# EAGLE design MX4-7-9-ESP12 (EAGLE 7.7.0)
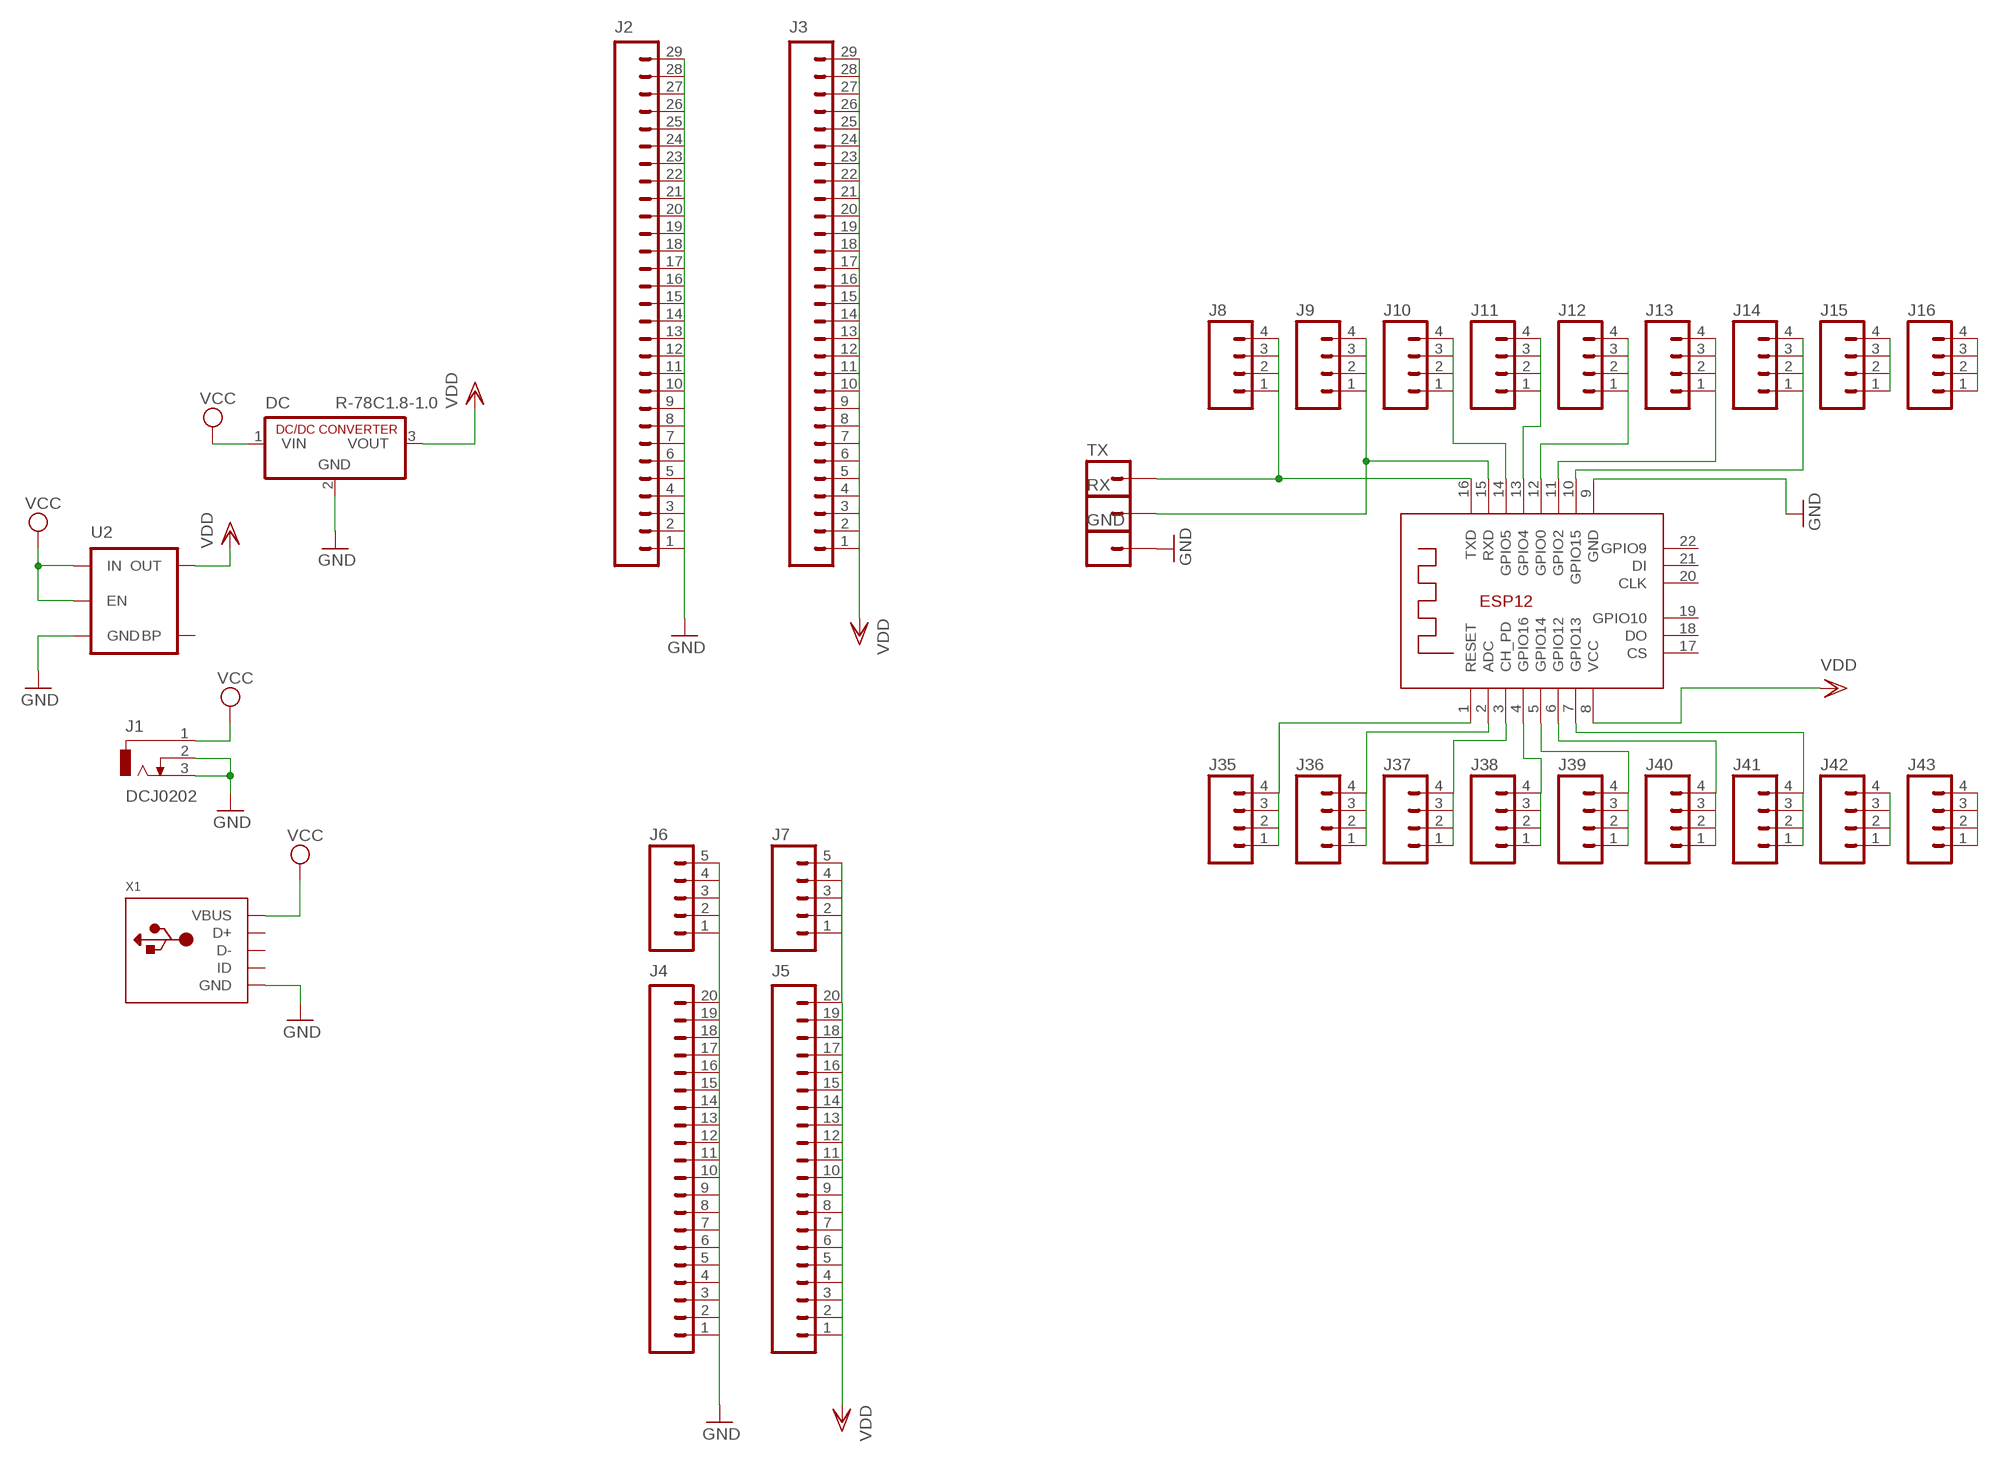
[diagram p0: schematic, sheet 1, part 1 of 2]
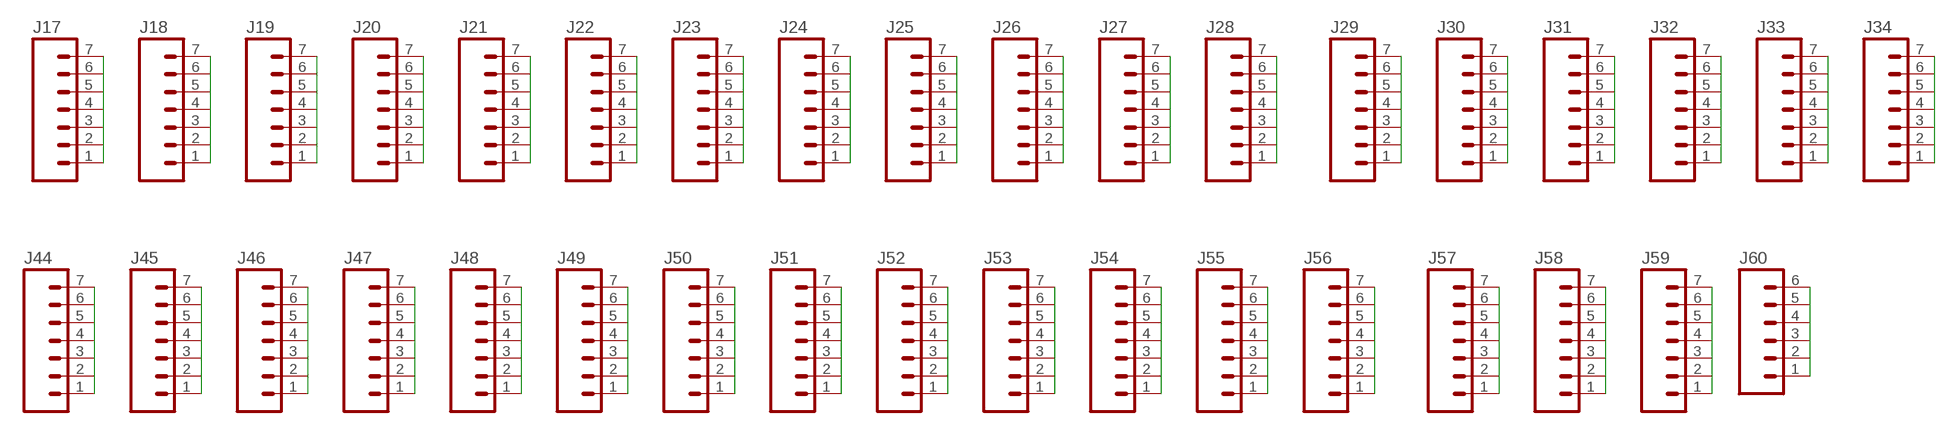
[diagram p1: schematic, sheet 1, part 2 of 2]

## Parts
DC  R-78C1.8-1.0  [SIP3]
GND  M01PTH_NO_SILK_YES_STOP  [1X01_NO_SILK]
J1  DCJ0202  [DCJ0202]
J2  M29NO_SILK  [1X29_NO_SILK]
J3  M29NO_SILK  [1X29_NO_SILK]
J4  M20NO_SILK_KIT  [1X20_NO_SILK_KIT]
J5  M20NO_SILK_KIT  [1X20_NO_SILK_KIT]
J6  M05NO_SILK  [1X05_NO_SILK]
J7  M05NO_SILK  [1X05_NO_SILK]
J8  M04NO_SILK_ALL_ROUND  [1X04_NO_SILK_ALL_ROUND]
J9  M04NO_SILK_ALL_ROUND  [1X04_NO_SILK_ALL_ROUND]
J10  M04NO_SILK_ALL_ROUND  [1X04_NO_SILK_ALL_ROUND]
J11  M04NO_SILK_ALL_ROUND  [1X04_NO_SILK_ALL_ROUND]
J12  M04NO_SILK_ALL_ROUND  [1X04_NO_SILK_ALL_ROUND]
J13  M04NO_SILK_ALL_ROUND  [1X04_NO_SILK_ALL_ROUND]
J14  M04NO_SILK_ALL_ROUND  [1X04_NO_SILK_ALL_ROUND]
J15  M04NO_SILK_ALL_ROUND  [1X04_NO_SILK_ALL_ROUND]
J16  M04NO_SILK_ALL_ROUND  [1X04_NO_SILK_ALL_ROUND]
J17  M07NO_SILK  [1X07_NO_SILK]
J18  M07NO_SILK  [1X07_NO_SILK]
J19  M07NO_SILK  [1X07_NO_SILK]
J20  M07NO_SILK  [1X07_NO_SILK]
J21  M07NO_SILK  [1X07_NO_SILK]
J22  M07NO_SILK  [1X07_NO_SILK]
J23  M07NO_SILK  [1X07_NO_SILK]
J24  M07NO_SILK  [1X07_NO_SILK]
J25  M07NO_SILK  [1X07_NO_SILK]
J26  M07NO_SILK  [1X07_NO_SILK]
J27  M07NO_SILK  [1X07_NO_SILK]
J28  M07NO_SILK  [1X07_NO_SILK]
J29  M07NO_SILK  [1X07_NO_SILK]
J30  M07NO_SILK  [1X07_NO_SILK]
J31  M07NO_SILK  [1X07_NO_SILK]
J32  M07NO_SILK  [1X07_NO_SILK]
J33  M07NO_SILK  [1X07_NO_SILK]
J34  M07NO_SILK  [1X07_NO_SILK]
J35  M04NO_SILK_ALL_ROUND  [1X04_NO_SILK_ALL_ROUND]
J36  M04NO_SILK_ALL_ROUND  [1X04_NO_SILK_ALL_ROUND]
J37  M04NO_SILK_ALL_ROUND  [1X04_NO_SILK_ALL_ROUND]
J38  M04NO_SILK_ALL_ROUND  [1X04_NO_SILK_ALL_ROUND]
J39  M04NO_SILK_ALL_ROUND  [1X04_NO_SILK_ALL_ROUND]
J40  M04NO_SILK_ALL_ROUND  [1X04_NO_SILK_ALL_ROUND]
J41  M04NO_SILK_ALL_ROUND  [1X04_NO_SILK_ALL_ROUND]
J42  M04NO_SILK_ALL_ROUND  [1X04_NO_SILK_ALL_ROUND]
J43  M04NO_SILK_ALL_ROUND  [1X04_NO_SILK_ALL_ROUND]
J44  M07NO_SILK  [1X07_NO_SILK]
J45  M07NO_SILK  [1X07_NO_SILK]
J46  M07NO_SILK  [1X07_NO_SILK]
J47  M07NO_SILK  [1X07_NO_SILK]
J48  M07NO_SILK  [1X07_NO_SILK]
J49  M07NO_SILK  [1X07_NO_SILK]
J50  M07NO_SILK  [1X07_NO_SILK]
J51  M07NO_SILK  [1X07_NO_SILK]
J52  M07NO_SILK  [1X07_NO_SILK]
J53  M07NO_SILK  [1X07_NO_SILK]
J54  M07NO_SILK  [1X07_NO_SILK]
J55  M07NO_SILK  [1X07_NO_SILK]
J56  M07NO_SILK  [1X07_NO_SILK]
J57  M07NO_SILK  [1X07_NO_SILK]
J58  M07NO_SILK  [1X07_NO_SILK]
J59  M07NO_SILK  [1X07_NO_SILK]
J60  M06NO_SILK_FEMALE_PTH  [1X06_NO_SILK]
RX  M01PTH_NO_SILK_YES_STOP  [1X01_NO_SILK]
TX  M01PTH_NO_SILK_YES_STOP  [1X01_NO_SILK]
U2  MIC52053.3V  [SOT23-5]
X1  USBMICRO_20329  [4UCONN_20329]
X2  ESP-12E  [ESP-12E]

## Nets
GND: DC.2(GND) GND.1 J1.2 J1.3 J2.1 J2.2 J2.3 J2.4 J2.5 J2.6 J2.7 J2.8 J2.9 J2.10 J2.11 J2.12 J2.13 J2.14 J2.15 J2.16 J2.17 J2.18 J2.19 J2.20 J2.21 J2.22 J2.23 J2.24 J2.25 J2.26 J2.27 J2.28 J2.29 J4.1 J4.2 J4.3 J4.4 J4.5 J4.6 J4.7 J4.8 J4.9 J4.10 J4.11 J4.12 J4.13 J4.14 J4.15 J4.16 J4.17 J4.18 J4.19 J4.20 J6.1 J6.2 J6.3 J6.4 J6.5 U2.2(GND) X1.BASE@1(GND) X1.BASE@2(GND) X1.GND X1.SPRT@1(GND) X1.SPRT@2(GND) X1.SPRT@3(GND) X1.SPRT@4(GND) X2.9(GND)
N$1: J8.1 J8.2 J8.3 J8.4 TX.1 X2.16(TXD)
N$2: J9.1 J9.2 J9.3 J9.4 RX.1 X2.15(RXD)
N$3: J10.1 J10.2 J10.3 J10.4 X2.14(GPIO5)
N$4: J11.1 J11.2 J11.3 J11.4 X2.13(GPIO4)
N$5: J12.1 J12.2 J12.3 J12.4 X2.12(GPIO0)
N$6: J13.1 J13.2 J13.3 J13.4 X2.11(GPIO2)
N$7: J14.1 J14.2 J14.3 J14.4 X2.10(GPIO15)
N$8: J15.1 J15.2 J15.3 J15.4
N$9: J16.1 J16.2 J16.3 J16.4
N$10: J17.1 J17.2 J17.3 J17.4 J17.5 J17.6 J17.7
N$11: J18.1 J18.2 J18.3 J18.4 J18.5 J18.6 J18.7
N$12: J19.1 J19.2 J19.3 J19.4 J19.5 J19.6 J19.7
N$13: J20.1 J20.2 J20.3 J20.4 J20.5 J20.6 J20.7
N$14: J21.1 J21.2 J21.3 J21.4 J21.5 J21.6 J21.7
N$15: J22.1 J22.2 J22.3 J22.4 J22.5 J22.6 J22.7
N$16: J23.1 J23.2 J23.3 J23.4 J23.5 J23.6 J23.7
N$17: J24.1 J24.2 J24.3 J24.4 J24.5 J24.6 J24.7
N$18: J25.1 J25.2 J25.3 J25.4 J25.5 J25.6 J25.7
N$19: J26.1 J26.2 J26.3 J26.4 J26.5 J26.6 J26.7
N$20: J27.1 J27.2 J27.3 J27.4 J27.5 J27.6 J27.7
N$21: J28.1 J28.2 J28.3 J28.4 J28.5 J28.6 J28.7
N$22: J29.1 J29.2 J29.3 J29.4 J29.5 J29.6 J29.7
N$23: J30.1 J30.2 J30.3 J30.4 J30.5 J30.6 J30.7
N$24: J31.1 J31.2 J31.3 J31.4 J31.5 J31.6 J31.7
N$25: J35.1 J35.2 J35.3 J35.4 X2.1(RESET)
N$26: J32.1 J32.2 J32.3 J32.4 J32.5 J32.6 J32.7
N$27: J33.1 J33.2 J33.3 J33.4 J33.5 J33.6 J33.7
N$28: J34.1 J34.2 J34.3 J34.4 J34.5 J34.6 J34.7
N$29: J36.1 J36.2 J36.3 J36.4 X2.2(ADC)
N$30: J37.1 J37.2 J37.3 J37.4 X2.3(CH_PD)
N$31: J38.1 J38.2 J38.3 J38.4 X2.4(GPIO16)
N$32: J39.1 J39.2 J39.3 J39.4 X2.5(GPIO14)
N$33: J40.1 J40.2 J40.3 J40.4 X2.6(GPIO12)
N$34: J41.1 J41.2 J41.3 J41.4 X2.7(GPIO13)
N$35: J42.1 J42.2 J42.3 J42.4
N$36: J43.1 J43.2 J43.3 J43.4
N$38: J44.1 J44.2 J44.3 J44.4 J44.5 J44.6 J44.7
N$39: J45.1 J45.2 J45.3 J45.4 J45.5 J45.6 J45.7
N$40: J46.1 J46.2 J46.3 J46.4 J46.5 J46.6 J46.7
N$41: J47.1 J47.2 J47.3 J47.4 J47.5 J47.6 J47.7
N$43: J48.1 J48.2 J48.3 J48.4 J48.5 J48.6 J48.7
N$44: J49.1 J49.2 J49.3 J49.4 J49.5 J49.6 J49.7
N$46: J50.1 J50.2 J50.3 J50.4 J50.5 J50.6 J50.7
N$47: J51.1 J51.2 J51.3 J51.4 J51.5 J51.6 J51.7
N$48: J52.1 J52.2 J52.3 J52.4 J52.5 J52.6 J52.7
N$49: J53.1 J53.2 J53.3 J53.4 J53.5 J53.6 J53.7
N$50: J54.1 J54.2 J54.3 J54.4 J54.5 J54.6 J54.7
N$51: J55.1 J55.2 J55.3 J55.4 J55.5 J55.6 J55.7
N$52: J56.1 J56.2 J56.3 J56.4 J56.5 J56.6 J56.7
N$53: J57.1 J57.2 J57.3 J57.4 J57.5 J57.6 J57.7
N$54: J58.1 J58.2 J58.3 J58.4 J58.5 J58.6 J58.7
N$55: J59.1 J59.2 J59.3 J59.4 J59.5 J59.6 J59.7
N$56: J60.1 J60.2 J60.3 J60.4 J60.5 J60.6
VCC: DC.1(VIN) J1.1 U2.1(IN) U2.3(EN) X1.VBUS
VDD: DC.3(VOUT) J3.1 J3.2 J3.3 J3.4 J3.5 J3.6 J3.7 J3.8 J3.9 J3.10 J3.11 J3.12 J3.13 J3.14 J3.15 J3.16 J3.17 J3.18 J3.19 J3.20 J3.21 J3.22 J3.23 J3.24 J3.25 J3.26 J3.27 J3.28 J3.29 J5.1 J5.2 J5.3 J5.4 J5.5 J5.6 J5.7 J5.8 J5.9 J5.10 J5.11 J5.12 J5.13 J5.14 J5.15 J5.16 J5.17 J5.18 J5.19 J5.20 J7.1 J7.2 J7.3 J7.4 J7.5 U2.5(OUT) X2.8(VCC)
Unconnected: U2.4(BP) X1.D+ X1.D- X1.ID X2.17(CS) X2.18(DO) X2.19(GPIO10) X2.20(CLK) X2.21(DI) X2.22(GPIO9)

## Library data of the parts
DC = dc-dc-converter:R-78C*-1.0: INNOLINE DC/DC-Converter 1.0 AMP SIP3 Single Output Source: Data sheet <http://www.mikrocontroller.net/attachment/150645/157764-da-01-en-DC_DC_WANDLER_R_78C5_0_1_0.pdf>
GND RX TX = SparkFun-Connectors:M01: Header 1 Standard 1-pin 0.1" header. Use with straight break away headers (SKU : PRT-00116), right angle break away headers (PRT-00553), swiss pins (PRT-00743), machine pins (PRT-00117), and female headers (PRT-00115). SMTSO-256-ET is a "flush mount" nut for a 4-40 screw. The older package used to be too tight, and did not allow it to sit properly thru the drill hit. The latest (0.165DIA) fits nice and snug.
J1 = con-jack:DCJ0202: DC POWER JACK Source: DCJ0202.pdf; OC_FARNELL: unknown; OC_NEWARK: unknown
J2 J3 = SparkFun-Connectors:M29: 1x29 .1" header
J4 J5 = SparkFun-Connectors:M20: 1x20 .1" header This is just like the LOCK variant in that the holes are staggared by 5 mil, but except for the last two holes. They are not altered from the "standard" footprint layout. This is used for a special purpose on the layout of our Graphic LCD Backpack. Make sure you want to use this device before selecting it for you project!
J6 J7 = SparkFun-Connectors:M05: Header 5 Standard 5-pin 0.1" header. Use with straight break away headers (SKU : PRT-00116), right angle break away headers (PRT-00553), swiss pins (PRT-00743), machine pins (PRT-00117), and female headers (PRT-00115). Molex polarized connector foot print use with SKU : PRT-08230 with associated crimp pins and housings.
J8-J16 J35-J43 = SparkFun-Connectors:M04: Header 4 Standard 4-pin 0.1" header. Use with straight break away headers (SKU : PRT-00116), right angle break away headers (PRT-00553), swiss pins (PRT-00743), machine pins (PRT-00117), and female headers (PRT-00115). Molex polarized connector foot print use with SKU : PRT-08231 with associated crimp pins and housings. 1MM SMD Version SKU: PRT-10208; PROD_ID: CONN-09696
J17-J34 J44-J59 = SparkFun-Connectors:M07: Header 7 Standard 7-pin 0.1" header. Use with straight break away headers (SKU : PRT-00116), right angle break away headers (PRT-00553), swiss pins (PRT-00743), machine pins (PRT-00117), and female headers (PRT-00115). NOTES ON THE VARIANTS LOCK and LOCK_LONGPADS... This footprint was designed to help hold the alignment of a through-hole component (i.e. 7-pin header) while soldering it into place. You may notice that each hole has been shifted either up or down by 0.005 of an inch from it's more standard position (which is usually a perfectly straight line). This slight alteration caused the pins (the squares in the middle) to touch the edges of the holes. Because they are alternating, it causes a "brace" to hold the header in place. 0.005 has proven to be the perfect amount of "off-center" position when using our standard breakaway headers. Although looks a little odd when you look at the bare footprint, once you have a header in there, the alteration is very hard to notice. Also, if you push a header all the way into place, it is covered up entirely on the bottom side. This idea of altering the position of holes to aid alignment will be further integrated into the Sparkfun Library for other footprints. It can help hold any component with 3 or more connection pins.
J60 = SparkFun-Connectors:M06: Header 6 Standard 6-pin 0.1" header. Use with straight break away headers (SKU : PRT-00116), right angle break away headers (PRT-00553), swiss pins (PRT-00743), machine pins (PRT-00117), and female headers (PRT-00115). Molex polarized connector foot print use with SKU : PRT-08094 with associated crimp pins and housings. NOTES ON THE VARIANTS LOCK and LOCK_LONGPADS... This footprint was designed to help hold the alignment of a through-hole component (i.e. 6-pin header) while soldering it into place. You may notice that each hole has been shifted either up or down by 0.005 of an inch from it's more standard position (which is a perfectly straight line). This slight alteration caused the pins (the squares in the middle) to touch the edges of the holes. Because they are alternating, it causes a "brace" to hold the component in place. 0.005 has proven to be the perfect amount of "off-center" position when using our standard breakaway headers. Although looks a little odd when you look at the bare footprint, once you have a header in there, the alteration is very hard to notice. Also,if you push a header all the way into place, it is covered up entirely on the bottom side. This idea of altering the position of holes to aid alignment will be further integrated into the Sparkfun Library for other footprints. It can help hold any component with 3 or more connection pins.; PROD_ID: CONN-08437
U2 = SparkFun-PowerIC:MIC5205: MIC5205 150mA vreg 3.3V - VREG-00822 5V - VREG-00823; PROD_ID: VREG-00822
X1 = microbuilder:USB: USB Connectors USBMINIB - Surface Mount Female Mini-B USB Connector 4UConnector: 06564
X2 = microbuilder:ESP-12E

## Net classes
0 default: width 0.508 mm, drill 0.508 mm, clearance 0.127 mm

## Board
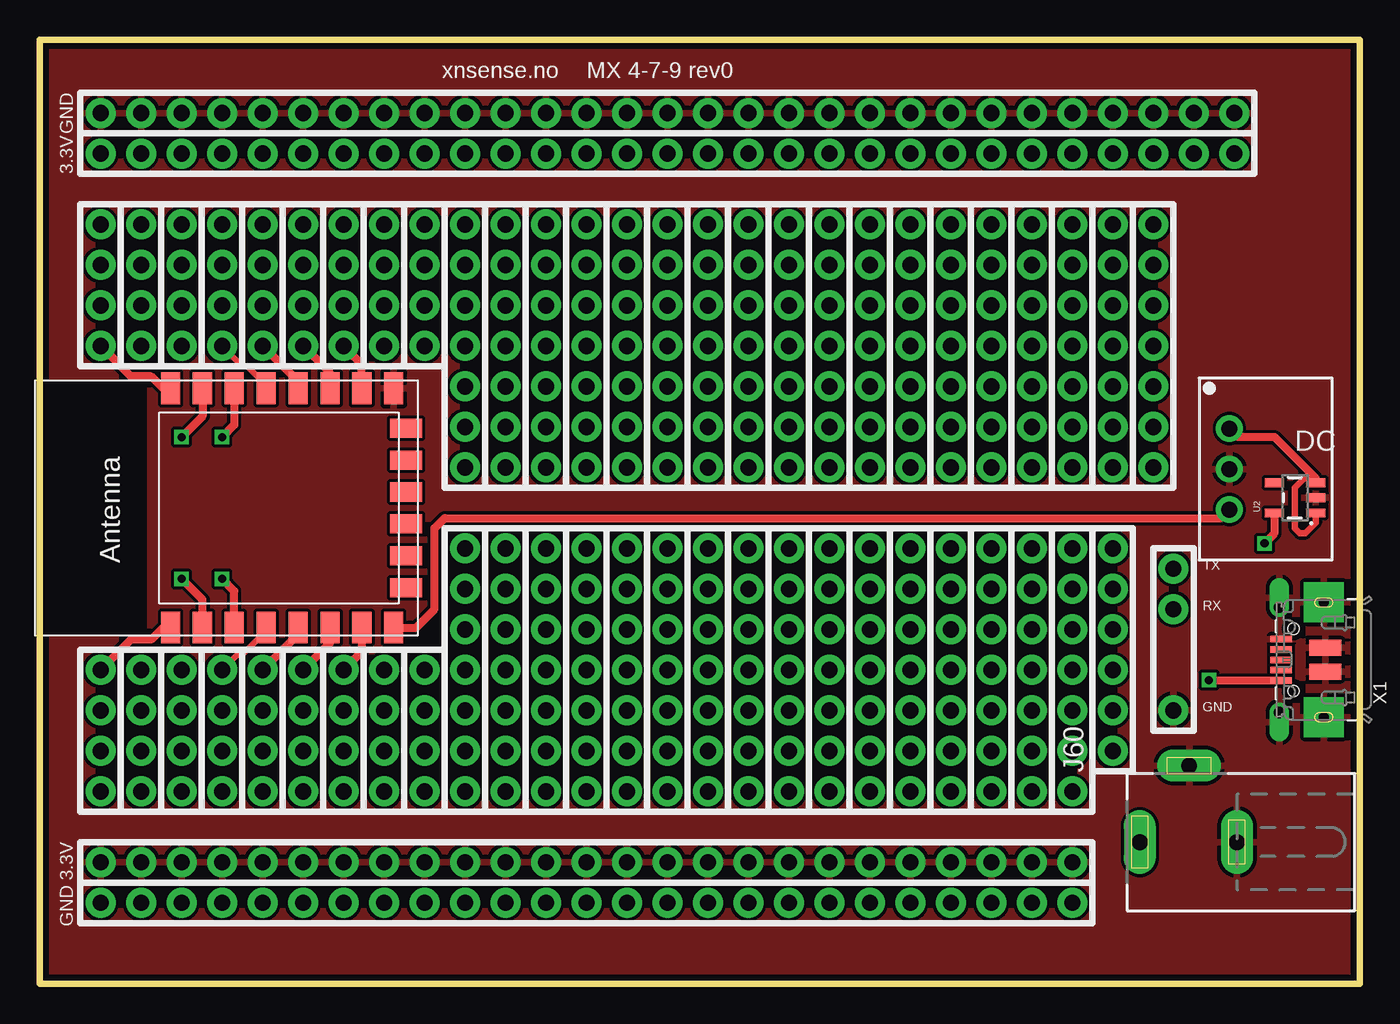
[diagram p2: board, top side]
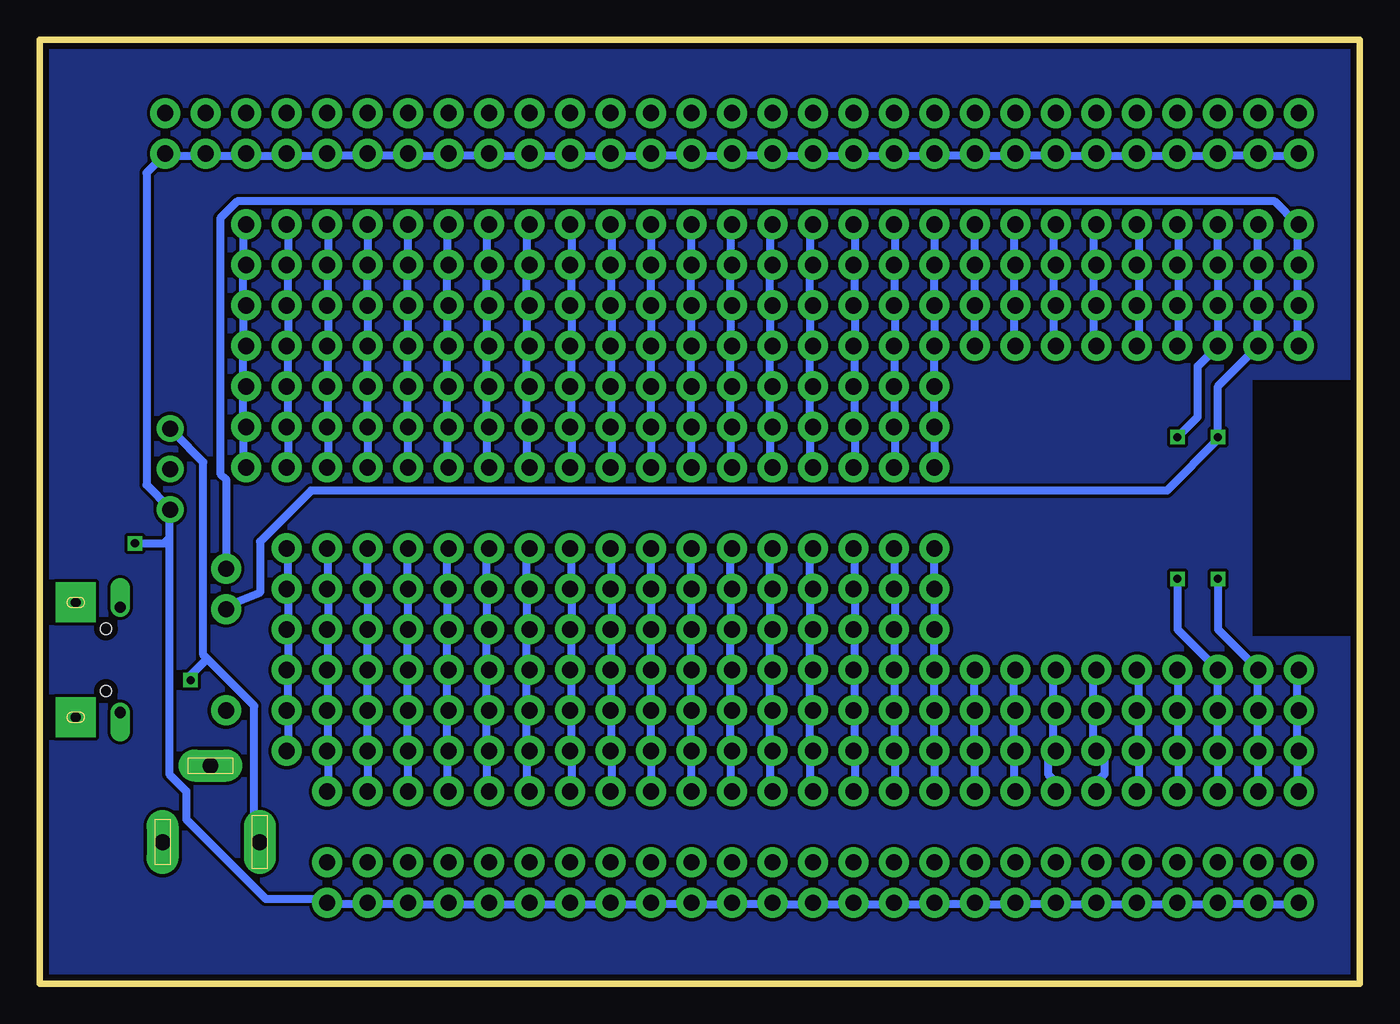
[diagram p3: board, bottom side, seen from below]

Size 82.8 x 59.2 mm. Coordinates in mm from the lower left corner, seen from the top.
Outline: 0,0 0,59.2 82.8,59.2 82.8,0 0,0
Copper layers (1*16): Top 0.035mm / dielectric 1.5mm / Bottom 0.035mm
Design rules "default *": minimum track width 10mil, minimum drill 20mil, track to track 8mil, track to pad 8mil, pad to pad 8mil, via to via 8mil, smd to smd 8mil, copper to edge 15mil, drill to drill 8mil, minimum pad ring 10mil, minimum via ring 8mil, stop-mask expansion 4mil, vias tented up to drill 0mil, thermal gap 10mil

### Footprints (pad centres in the part's own frame; a part is rotated, then mirrored left to right if it is on the bottom)
SIP3 = drill 1 pad 1.676: 1 -2.54,0; 2 0,0; 3 2.54,0
1X01_NO_SILK = drill 1.016 pad 1.88: 1 0,0
DCJ0202 = drill 1 pad 2 long: 1 0,3.1; 2 4.8,0; 3 0,-3
1X29_NO_SILK = drill 1.016 pad 1.88: 1 0,0; 2 2.54,0; 3 5.08,0; 4 7.62,0; 5 10.16,0; 6 12.7,0; 7 15.24,0; 8 17.78,0; 9 20.32,0; 10 22.86,0; 11 25.4,0; 12 27.94,0; 13 30.48,0; 14 33.02,0; 15 35.56,0; 16 38.1,0; 17 40.64,0; 18 43.18,0; 19 45.72,0; 20 48.26,0; 21 50.8,0; 22 53.34,0; 23 55.88,0; 24 58.42,0; 25 60.96,0; 26 63.5,0; 27 66.04,0; 28 68.58,0; 29 71.12,0
1X20_NO_SILK_KIT = drill 1.016 pad 1.88: 1 0,0; 2 2.54,0; 3 5.08,0; 4 7.62,0; 5 10.16,0; 6 12.7,0; 7 15.24,0; 8 17.78,0; 9 20.32,0; 10 22.86,0; 11 25.4,0; 12 27.94,0; 13 30.48,0; 14 33.02,0; 15 35.56,0; 16 38.1,0; 17 40.64,0; 18 43.18,0; 19 45.72,0; 20 48.26,0
1X05_NO_SILK = drill 1.016 pad 1.88: 1 0,0; 2 2.54,0; 3 5.08,0; 4 7.62,0; 5 10.16,0
1X04_NO_SILK_ALL_ROUND = drill 1.016 pad 1.88: 1 0,0; 2 2.54,0; 3 5.08,0; 4 7.62,0
1X07_NO_SILK = drill 1.016 pad 1.88: 1 0,0; 2 2.54,0; 3 5.08,0; 4 7.62,0; 5 10.16,0; 6 12.7,0; 7 15.24,0
1X06_NO_SILK = drill 1.016 pad 1.88: 1 0,0; 2 2.54,0; 3 5.08,0; 4 7.62,0; 5 10.16,0; 6 12.7,0
SOT23-5 = smd 0.55 x 1.2: 1 -0.95,-1.3; 2 0,-1.3; 3 0.95,-1.3; 4 0.95,1.3; 5 -0.95,1.3
4UCONN_20329 = smd 1 x 2: BASE@1 -0.75,-2; BASE@2 0.75,-2 | smd 0.4 x 1.35: D+ 0,0.775; D- -0.65,0.775; GND 1.3,0.775; ID 0.65,0.775; VBUS -1.3,0.775 | drill 0.7 offset: SPRT@1 -3.3,0.9; SPRT@2 3.3,0.9 | drill 0.6 pad 2.5 square: SPRT@3 -3.6,-1.9; SPRT@4 3.6,-1.9 | hole 0.7: -1.95,0; 1.95,0
ESP-12E = smd 2 x 1.2: 1 -7.5,5.77; 2 -7.5,3.77; 3 -7.5,1.77; 4 -7.5,-0.23; 5 -7.5,-2.23; 6 -7.5,-4.23; 7 -7.5,-6.23; 8 -7.5,-8.23; 9 7.5,-8.23; 10 7.5,-6.23; 11 7.5,-4.23; 12 7.5,-2.23; 13 7.5,-0.23; 14 7.5,1.77; 15 7.5,3.77; 16 7.5,5.77 | smd 1.2 x 2: 17 -5,-9; 18 -3,-9; 19 -1,-9; 20 1,-9; 21 3,-9; 22 5,-9

### Placement (x,y rotation side)
DC  74.63,32.28 270 top
GND  71.12,17.14 0 top
J1  72.1,8.89 90 top
J2  3.81,54.61 0 top
J3  3.81,52.07 0 top
J4  3.81,7.62 0 top
J5  3.81,5.08 0 top
J6  54.61,7.62 0 top
J7  54.61,5.08 0 top
J8  3.81,40.01 90 top
J9  6.35,40.01 90 top
J10  8.89,40.01 90 top
J11  11.43,40.01 90 top
J12  13.97,40.01 90 top
J13  16.51,40.01 90 top
J14  19.05,40.01 90 top
J15  21.59,40.01 90 top
J16  21.59,12.06 90 top
J17  26.67,32.38 90 top
J18  29.21,32.38 90 top
J19  31.75,32.38 90 top
J20  34.29,32.38 90 top
J21  36.83,32.38 90 top
J22  39.37,32.38 90 top
J23  41.91,32.38 90 top
J24  44.45,32.38 90 top
J25  46.99,32.38 90 top
J26  49.53,32.38 90 top
J27  52.07,32.38 90 top
J28  54.61,32.38 90 top
J29  57.15,32.38 90 top
J30  59.69,32.38 90 top
J31  62.23,32.38 90 top
J32  64.77,32.38 90 top
J33  67.31,32.38 90 top
J34  69.85,32.38 90 top
J35  3.81,19.68 270 top
J36  6.35,12.06 90 top
J37  8.89,12.06 90 top
J38  11.43,12.06 90 top
J39  13.97,12.06 90 top
J40  16.51,12.06 90 top
J41  19.05,12.06 90 top
J42  24.13,40.01 90 top
J43  24.13,12.06 90 top
J44  26.67,12.06 90 top
J45  29.21,12.06 90 top
J46  31.75,12.06 90 top
J47  34.29,12.06 90 top
J48  36.83,12.06 90 top
J49  39.37,12.06 90 top
J50  41.91,12.06 90 top
J51  44.45,12.06 90 top
J52  46.99,12.06 90 top
J53  49.53,12.06 90 top
J54  52.07,12.06 90 top
J55  54.61,12.06 90 top
J56  57.15,12.06 90 top
J57  59.69,12.06 90 top
J58  62.23,12.06 90 top
J59  64.77,12.06 90 top
J60  67.31,14.61 90 top
RX  71.12,23.5 0 top
TX  71.12,26.04 0 top
U2  78.74,30.48 90 top
X1  78.65,20.32 90 top
X2  13.97,29.84 90 top

### Tracks (layer width: path | path; a pad name or v marks a point on that pad's centre or on a via)
GND
  pour Top: 0,59.2 0,0 82.8,0 82.8,59.2
N$1
  Top 0.508: X2.16 7.74,37.34 6.99,38.1 5.71,38.1 J8.1
  Bottom 0.508: J8.1 3.91,40.18 3.91,42.32 J8.2 3.91,42.67 3.91,44.81 J8.3 3.91,45.16 3.91,47.3 J8.4 3.91,47.65 5.33,49.07 70.41,49.07 71.48,48.01 71.48,32 71.12,31.65 TX.1
N$2  (via drill 0.51)
  Top 0.508: X2.15 10.2,35.6 v8.89,34.29
  Bottom 0.508: J9.4 6.4,47.3 6.4,45.16 J9.3 6.4,44.81 6.4,42.67 J9.2 6.4,42.32 6.4,40.18 J9.1 8.89,37.47 v8.89,34.29 8.89,34.14 12.09,30.94 65.79,30.94 68.99,27.74 68.99,24.54 71.12,23.67 RX.1
N$3  (via drill 0.51)
  Top 0.508: X2.14 12.2,35.06 v11.43,34.29
  Bottom 0.508: v11.43,34.29 10.16,35.56 10.16,38.73 J10.1 J10.2 J10.3 J10.4
N$4
  Top 0.406: X2.13 14.2,37.55 13.02,38.73 12.7,38.73 J11.1
  Bottom 0.508: J11.1 11.38,40.18 11.38,42.32 J11.2 11.38,42.67 11.38,44.81 J11.3 11.38,45.16 11.38,47.3 J11.4
N$5
  Top 0.508: X2.12 16.2,37.77 J12.1
  Bottom 0.508: J12.1 13.87,40.18 13.87,42.32 J12.2 13.87,42.67 13.87,44.81 J12.3 13.87,45.16 13.87,47.3 J12.4
N$6
  Top 0.508: X2.11 18.2,38.31 J13.1
  Bottom 0.508: J13.1 16.71,40.18 16.71,42.32 J13.2 16.71,42.67 16.71,44.81 J13.3 16.71,45.16 16.71,47.3 J13.4
N$7
  Top 0.508: X2.10 20.2,38.85 J14.1
  Bottom 0.508: J14.1 19.2,40.18 19.2,42.32 J14.2 19.2,42.67 19.2,44.81 J14.3 19.2,45.16 19.2,47.3 J14.4
N$8
  Bottom 0.508: J15.1 21.69,40.18 21.69,42.32 J15.2 21.69,42.67 21.69,44.81 J15.3 21.69,45.16 21.69,47.3 J15.4
N$9
  Bottom 0.508: J16.1 21.69,12.09 21.69,14.58 J16.2 21.69,14.94 21.69,17.07 J16.3 21.69,17.42 21.69,19.56 J16.4
N$10
  Bottom 0.508: J17.7 J17.6 J17.5 J17.4 J17.3 J17.2 J17.1
N$11
  Bottom 0.508: J18.7 29.16,47.3 29.16,45.16 J18.6 29.16,44.81 29.16,42.67 J18.5 29.16,42.32 29.16,40.18 J18.4 29.16,39.83 29.16,37.69 J18.3 29.16,37.34 29.16,35.2 J18.2 29.16,34.85 29.16,32.72 J18.1
N$12
  Bottom 0.508: J19.7 31.65,47.3 31.65,45.16 J19.6 31.65,44.81 31.65,42.67 J19.5 31.65,42.32 31.65,40.18 J19.4 31.65,39.83 31.65,37.69 J19.3 31.65,37.34 31.65,35.2 J19.2 31.65,34.85 31.65,32.72 J19.1
N$13
  Bottom 0.508: J20.7 34.49,47.3 34.49,45.16 J20.6 34.49,44.81 34.49,42.67 J20.5 34.49,42.32 34.49,40.18 J20.4 34.49,39.83 34.49,37.69 J20.3 34.49,37.34 34.49,35.2 J20.2 34.49,34.85 34.49,32.72 J20.1
N$14
  Bottom 0.508: J21.7 36.98,47.3 36.98,45.16 J21.6 36.98,44.81 36.98,42.67 J21.5 36.98,42.32 36.98,40.18 J21.4 36.98,39.83 36.98,37.69 J21.3 36.98,37.34 36.98,35.2 J21.2 36.98,34.85 36.98,32.72 J21.1
N$15
  Bottom 0.508: J22.7 39.47,47.3 39.47,45.16 J22.6 39.47,44.81 39.47,42.67 J22.5 39.47,42.32 39.47,40.18 J22.4 39.47,39.83 39.47,37.69 J22.3 39.47,37.34 39.47,35.2 J22.2 39.47,34.85 39.47,32.72 J22.1
N$16
  Bottom 0.508: J23.7 41.96,47.3 41.96,45.16 J23.6 41.96,44.81 41.96,42.67 J23.5 41.96,42.32 41.96,40.18 J23.4 41.96,39.83 41.96,37.69 J23.3 41.96,37.34 41.96,35.2 J23.2 41.96,34.85 41.96,32.72 J23.1
N$17
  Bottom 0.508: J24.7 J24.6 J24.5 J24.4 J24.3 J24.2 J24.1
N$18
  Bottom 0.508: J25.7 46.94,47.3 46.94,45.16 J25.6 46.94,44.81 46.94,42.67 J25.5 46.94,42.32 46.94,40.18 J25.4 46.94,39.83 46.94,37.69 J25.3 46.94,37.34 46.94,35.2 J25.2 46.94,34.85 46.94,32.72 J25.1
N$19
  Bottom 0.508: J26.7 49.43,47.3 49.43,45.16 J26.6 49.43,44.81 49.43,42.67 J26.5 49.43,42.32 49.43,40.18 J26.4 49.43,39.83 49.43,37.69 J26.3 49.43,37.34 49.43,35.2 J26.2 49.43,34.85 49.43,32.72 J26.1
N$20
  Bottom 0.508: J27.7 52.27,47.3 52.27,45.16 J27.6 52.27,44.81 52.27,42.67 J27.5 52.27,42.32 52.27,40.18 J27.4 52.27,39.83 52.27,37.69 J27.3 52.27,37.34 52.27,35.2 J27.2 52.27,34.85 52.27,32.72 J27.1
N$21
  Bottom 0.508: J28.7 54.76,47.3 54.76,45.16 J28.6 54.76,44.81 54.76,42.67 J28.5 54.76,42.32 54.76,40.18 J28.4 54.76,39.83 54.76,37.69 J28.3 54.76,37.34 54.76,35.2 J28.2 54.76,34.85 54.76,32.72 J28.1
N$22
  Bottom 0.508: J29.7 57.25,47.3 57.25,45.16 J29.6 57.25,44.81 57.25,42.67 J29.5 57.25,42.32 57.25,40.18 J29.4 57.25,39.83 57.25,37.69 J29.3 57.25,37.34 57.25,35.2 J29.2 57.25,34.85 57.25,32.72 J29.1
N$23
  Bottom 0.508: J30.7 59.74,47.3 59.74,45.16 J30.6 59.74,44.81 59.74,42.67 J30.5 59.74,42.32 59.74,40.18 J30.4 59.74,39.83 59.74,37.69 J30.3 59.74,37.34 59.74,35.2 J30.2 59.74,34.85 59.74,32.72 J30.1
N$24
  Bottom 0.508: J31.7 J31.6 J31.5 J31.4 J31.3 J31.2 J31.1
N$25
  Top 0.508: X2.1 7.74,22.34 6.99,21.59 5.71,21.59 J35.1
  Bottom 0.508: J35.4 3.91,12.09 3.91,14.58 J35.3 3.91,14.94 3.91,17.07 J35.2 3.91,17.42 3.91,19.56 J35.1
N$26
  Bottom 0.508: J32.7 64.72,47.3 64.72,45.16 J32.6 64.72,44.81 64.72,42.67 J32.5 64.72,42.32 64.72,40.18 J32.4 64.72,39.83 64.72,37.69 J32.3 64.72,37.34 64.72,35.2 J32.2 64.72,34.85 64.72,32.72 J32.1
N$27
  Bottom 0.508: J33.7 67.21,47.3 67.21,45.16 J33.6 67.21,44.81 67.21,42.67 J33.5 67.21,42.32 67.21,40.18 J33.4 67.21,39.83 67.21,37.69 J33.3 67.21,37.34 67.21,35.2 J33.2 67.21,34.85 67.21,32.72 J33.1
N$28
  Bottom 0.508: J34.7 70.05,47.3 70.05,45.16 J34.6 70.05,44.81 70.05,42.67 J34.5 70.05,42.32 70.05,40.18 J34.4 70.05,39.83 70.05,37.69 J34.3 70.05,37.34 70.05,35.2 J34.2 70.05,34.85 70.05,32.72 J34.1
N$29  (via drill 0.51)
  Top 0.508: X2.2 10.2,24.09 v8.89,25.4
  Bottom 0.508: v8.89,25.4 8.89,22.23 J36.4 6.4,19.56 6.4,17.42 J36.3 6.4,17.07 6.4,14.94 J36.2 6.4,14.58 6.4,12.09 J36.1
N$30  (via drill 0.51)
  Top 0.508: X2.3 12.2,24.63 v11.43,25.4
  Bottom 0.508: v11.43,25.4 11.43,22.23 J37.4 J37.3 J37.2 J37.1
N$31
  Top 0.406: 14.2,22.14 12.7,20.64 12.38,20.64 J38.4
  Top 0.508: X2.4 14.2,22.14
  Bottom 0.508: J38.1 11.38,12.09 11.38,14.58 J38.2 11.38,14.94 11.38,17.07 J38.3 11.38,17.42 11.38,19.56 J38.4
N$32
  Top 0.508: X2.5 16.2,21.91 J39.4
  Bottom 0.508: J39.1 13.87,12.09 13.87,14.58 J39.2 13.87,14.94 13.87,17.07 J39.3 13.87,17.42 13.87,19.56 J39.4
N$33
  Top 0.508: X2.6 18.2,21.38 J40.4
  Bottom 0.508: J40.1 16.36,12.09 16.36,12.8 16,13.16 16,14.22 16.36,14.58 J40.2 16.71,14.94 16.71,17.07 J40.3 16.71,17.42 16.71,19.56 J40.4
N$34
  Top 0.508: X2.7 20.2,20.84 J41.4
  Bottom 0.508: J41.1 19.2,12.09 19.2,12.8 19.56,13.16 19.56,14.22 19.2,14.58 J41.2 19.2,14.94 19.2,17.07 J41.3 19.2,17.42 19.2,19.56 J41.4
N$35
  Bottom 0.508: J42.1 24.18,40.18 24.18,42.32 J42.2 24.18,42.67 24.18,44.81 J42.3 24.18,45.16 24.18,47.3 J42.4
N$36
  Bottom 0.508: J43.1 24.18,12.09 24.18,14.58 J43.2 24.18,14.94 24.18,17.07 J43.3 24.18,17.42 24.18,19.56 J43.4
N$38
  Bottom 0.508: J44.7 J44.6 J44.5 J44.4 J44.3 J44.2 J44.1
N$39
  Bottom 0.508: J45.7 29.16,27.03 29.16,24.89 J45.6 29.16,24.54 29.16,22.4 J45.5 29.16,22.05 29.16,19.91 J45.4 29.16,19.56 29.16,17.42 J45.3 29.16,17.07 29.16,14.94 J45.2 29.16,14.58 29.16,12.09 J45.1
N$40
  Bottom 0.508: J46.7 31.65,27.03 31.65,24.89 J46.6 31.65,24.54 31.65,22.4 J46.5 31.65,22.05 31.65,19.91 J46.4 31.65,19.56 31.65,17.42 J46.3 31.65,17.07 31.65,14.94 J46.2 31.65,14.58 31.65,12.09 J46.1
N$41
  Bottom 0.508: J47.7 34.49,27.03 34.49,24.89 J47.6 34.49,24.54 34.49,22.4 J47.5 34.49,22.05 34.49,19.91 J47.4 34.49,19.56 34.49,17.42 J47.3 34.49,17.07 34.49,14.94 J47.2 34.49,14.58 34.49,12.09 J47.1
N$43
  Bottom 0.508: J48.7 36.98,27.03 36.98,24.89 J48.6 36.98,24.54 36.98,22.4 J48.5 36.98,22.05 36.98,19.91 J48.4 36.98,19.56 36.98,17.42 J48.3 36.98,17.07 36.98,14.94 J48.2 36.98,14.58 36.98,12.09 J48.1
N$44
  Bottom 0.508: J49.7 39.47,27.03 39.47,24.89 J49.6 39.47,24.54 39.47,22.4 J49.5 39.47,22.05 39.47,19.91 J49.4 39.47,19.56 39.47,17.42 J49.3 39.47,17.07 39.47,14.94 J49.2 39.47,14.58 39.47,12.09 J49.1
N$45
  pour Bottom: 0,59.2 82.8,59.2 82.8,0 0,0
N$46
  Bottom 0.508: J50.7 41.96,27.03 41.96,24.89 J50.6 41.96,24.54 41.96,22.4 J50.5 41.96,22.05 41.96,19.91 J50.4 41.96,19.56 41.96,17.42 J50.3 41.96,17.07 41.96,14.94 J50.2 41.96,14.58 41.96,12.09 J50.1
N$47
  Bottom 0.508: J51.7 J51.6 J51.5 J51.4 J51.3 J51.2 J51.1
N$48
  Bottom 0.508: J52.7 46.94,27.03 46.94,24.89 J52.6 46.94,24.54 46.94,22.4 J52.5 46.94,22.05 46.94,19.91 J52.4 46.94,19.56 46.94,17.42 J52.3 46.94,17.07 46.94,14.94 J52.2 46.94,14.58 46.94,12.09 J52.1
N$49
  Bottom 0.508: J53.7 49.43,27.03 49.43,24.89 J53.6 49.43,24.54 49.43,22.4 J53.5 49.43,22.05 49.43,19.91 J53.4 49.43,19.56 49.43,17.42 J53.3 49.43,17.07 49.43,14.94 J53.2 49.43,14.58 49.43,12.09 J53.1
N$50
  Bottom 0.508: J54.7 52.27,27.03 52.27,24.89 J54.6 52.27,24.54 52.27,22.4 J54.5 52.27,22.05 52.27,19.91 J54.4 52.27,19.56 52.27,17.42 J54.3 52.27,17.07 52.27,14.94 J54.2 52.27,14.58 52.27,12.09 J54.1
N$51
  Bottom 0.508: J55.7 54.76,27.03 54.76,24.89 J55.6 54.76,24.54 54.76,22.4 J55.5 54.76,22.05 54.76,19.91 J55.4 54.76,19.56 54.76,17.42 J55.3 54.76,17.07 54.76,14.94 J55.2 54.76,14.58 54.76,12.09 J55.1
N$52
  Bottom 0.508: J56.7 57.25,27.03 57.25,24.89 J56.6 57.25,24.54 57.25,22.4 J56.5 57.25,22.05 57.25,19.91 J56.4 57.25,19.56 57.25,17.42 J56.3 57.25,17.07 57.25,14.94 J56.2 57.25,14.58 57.25,12.09 J56.1
N$53
  Bottom 0.508: J57.7 59.74,27.03 59.74,24.89 J57.6 59.74,24.54 59.74,22.4 J57.5 59.74,22.05 59.74,19.91 J57.4 59.74,19.56 59.74,17.42 J57.3 59.74,17.07 59.74,14.94 J57.2 59.74,14.58 59.74,12.09 J57.1
N$54
  Bottom 0.508: J58.7 J58.6 J58.5 J58.4 J58.3 J58.2 J58.1
N$55
  Bottom 0.508: J59.7 64.72,27.03 64.72,24.89 J59.6 64.72,24.54 64.72,22.4 J59.5 64.72,22.05 64.72,19.91 J59.4 64.72,19.56 64.72,17.42 J59.3 64.72,17.07 64.72,14.94 J59.2 64.72,14.58 64.72,12.09 J59.1
N$56
  Bottom 0.508: J60.1 67.21,14.94 67.21,17.07 J60.2 67.21,17.42 67.21,19.56 J60.3 67.21,19.91 67.21,22.05 J60.4 67.21,22.4 67.21,24.54 J60.5 67.21,24.89 67.21,27.03 J60.6
VCC  (via drill 0.51)
  Top 0.406: U2.1 80.04,28.92 79.38,28.26 79.06,28.26 78.74,28.57 78.74,31.11 79.69,32.07
  Top 0.508: U2.3 80.04,31.72 79.69,32.07 77.47,34.29 75.17,34.29 DC.1 | X1.VBUS 73.37,19.02 v73.34,19.05
  Bottom 0.508: 72.31,20.4 69.34,17.42 69.34,8.89 J1.1 | 72.31,20.4 72.54,20.62 72.54,32.72 74.32,34.49 DC.1 | v73.34,19.05 73.34,19.37 72.31,20.4
VDD  (via drill 0.51)
  Top 0.508: X2.8 23.61,22.34 24.77,23.5 24.77,28.57 25.4,29.21 74.09,29.21 DC.3 | U2.5 77.44,28.23 v76.83,27.62
  Bottom 0.508: 26.67,4.98 24.18,4.98 J5.9 23.82,4.98 21.69,4.98 J5.8 21.34,4.98 19.2,4.98 J5.7 18.85,4.98 16.71,4.98 J5.6 16.36,4.98 14.22,4.98 J5.5 13.87,4.98 11.73,4.98 J5.4 11.38,4.98 8.89,4.98 | J5.1 3.91,4.98 6.04,4.98 J5.2 6.4,4.98 8.89,4.98 | 8.89,4.98 J5.3 | 44.45,4.98 41.96,4.98 J5.16 41.6,4.98 39.47,4.98 J5.15 39.12,4.98 36.98,4.98 J5.14 36.63,4.98 34.49,4.98 J5.13 34.14,4.98 32,4.98 J5.12 31.65,4.98 29.52,4.98 J5.11 29.16,4.98 26.67,4.98 | 62.23,4.98 59.74,4.98 J7.3 59.38,4.98 57.25,4.98 J7.2 56.9,4.98 54.76,4.98 J7.1 54.41,4.98 52.27,4.98 J5.20 51.92,4.98 49.78,4.98 J5.19 49.43,4.98 47.3,4.98 J5.18 46.94,4.98 44.45,4.98 | 62.23,4.98 64.72,4.98 J7.5 65.08,5.33 68.63,5.33 73.61,10.31 73.61,12.09 74.68,13.16 74.68,27.94 | 62.23,4.98 J7.4 | 44.45,4.98 J5.17 | 26.67,4.98 J5.10 | 26.67,51.92 24.18,51.92 J3.9 23.82,51.92 21.69,51.92 J3.8 21.34,51.92 19.2,51.92 J3.7 18.85,51.92 16.71,51.92 J3.6 16.36,51.92 14.22,51.92 J3.5 13.87,51.92 11.73,51.92 J3.4 11.38,51.92 8.89,51.92 | J3.1 3.91,51.92 6.04,51.92 J3.2 6.4,51.92 8.89,51.92 | 8.89,51.92 J3.3 | 44.45,51.92 41.96,51.92 J3.16 41.6,51.92 39.47,51.92 J3.15 39.12,51.92 36.98,51.92 J3.14 36.63,51.92 34.49,51.92 J3.13 34.14,51.92 32,51.92 J3.12 31.65,51.92 29.52,51.92 J3.11 29.16,51.92 26.67,51.92 | 62.23,51.92 59.74,51.92 J3.23 59.38,51.92 57.25,51.92 J3.22 56.9,51.92 54.76,51.92 J3.21 54.41,51.92 52.27,51.92 J3.20 51.92,51.92 49.78,51.92 J3.19 49.43,51.92 47.3,51.92 J3.18 46.94,51.92 44.45,51.92 | 44.45,51.92 J3.17 | 26.67,51.92 J3.10 | 62.23,51.92 64.72,51.92 J3.25 65.08,51.92 67.21,51.92 J3.26 67.56,51.92 69.7,51.92 J3.27 70.05,51.92 72.19,51.92 J3.28 72.54,51.92 74.68,51.92 J3.29 75.03,51.92 76.1,50.85 76.1,31.29 74.68,29.87 DC.3 74.68,29.52 74.68,27.94
  Bottom 0.508: 62.23,51.92 J3.24 | v76.83,27.62 74.99,27.62 74.68,27.94

### Text on the board
tNames: xnsense.no | MX 4-7-9 rev0 | GND | 3.3V | 3.3V | GND